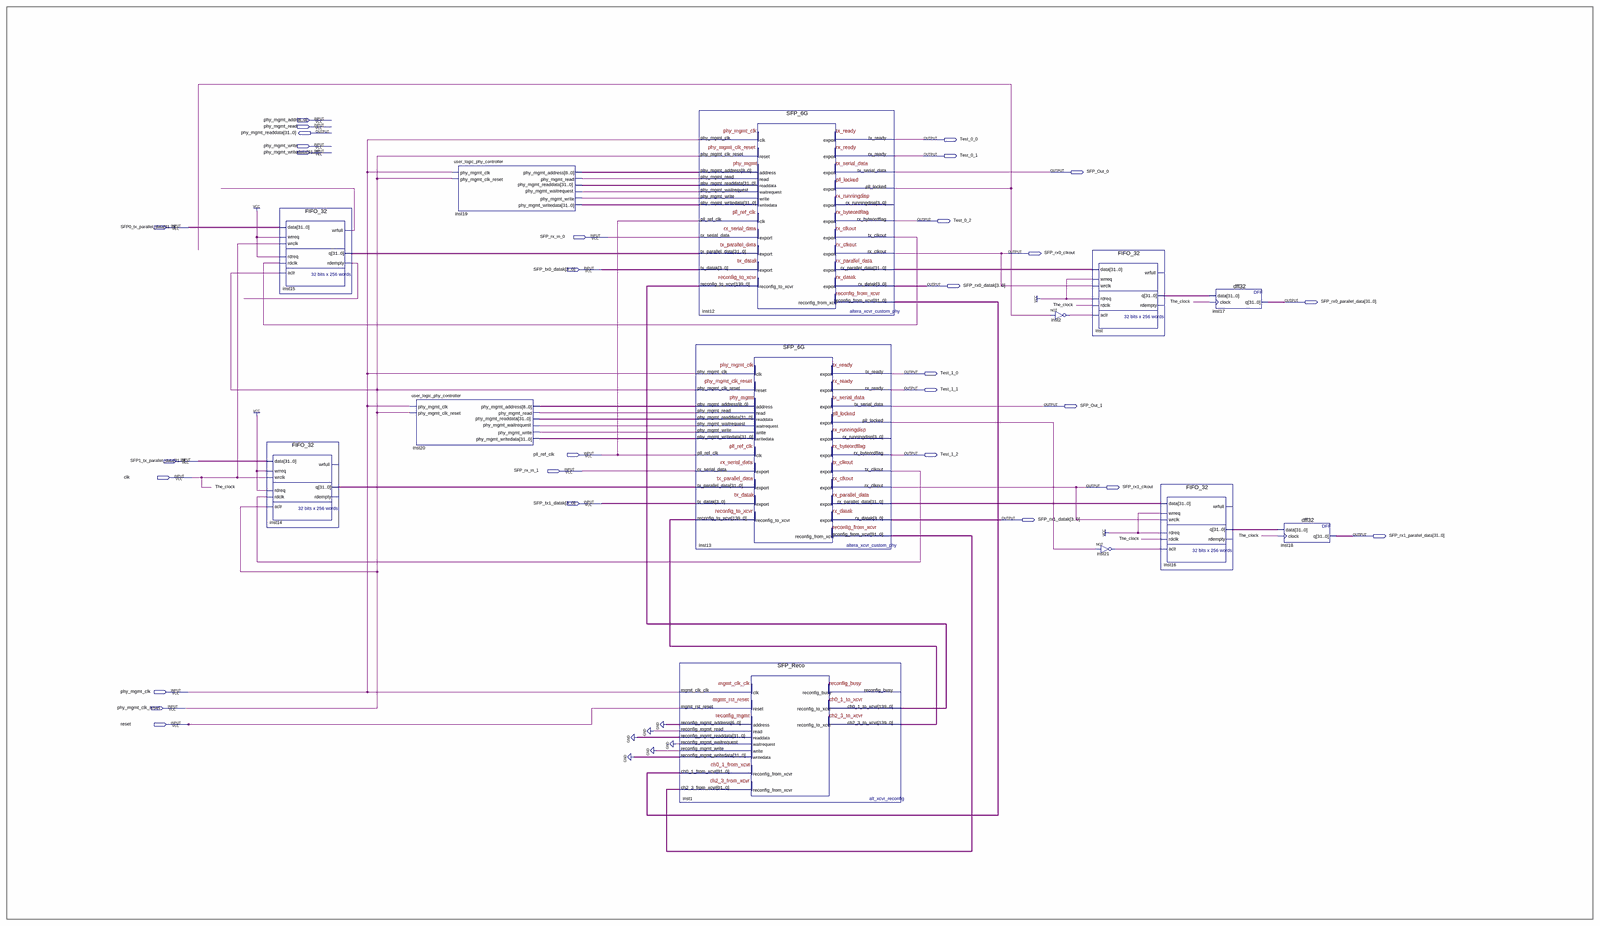
[diagram p0: schematic sheet, whole]
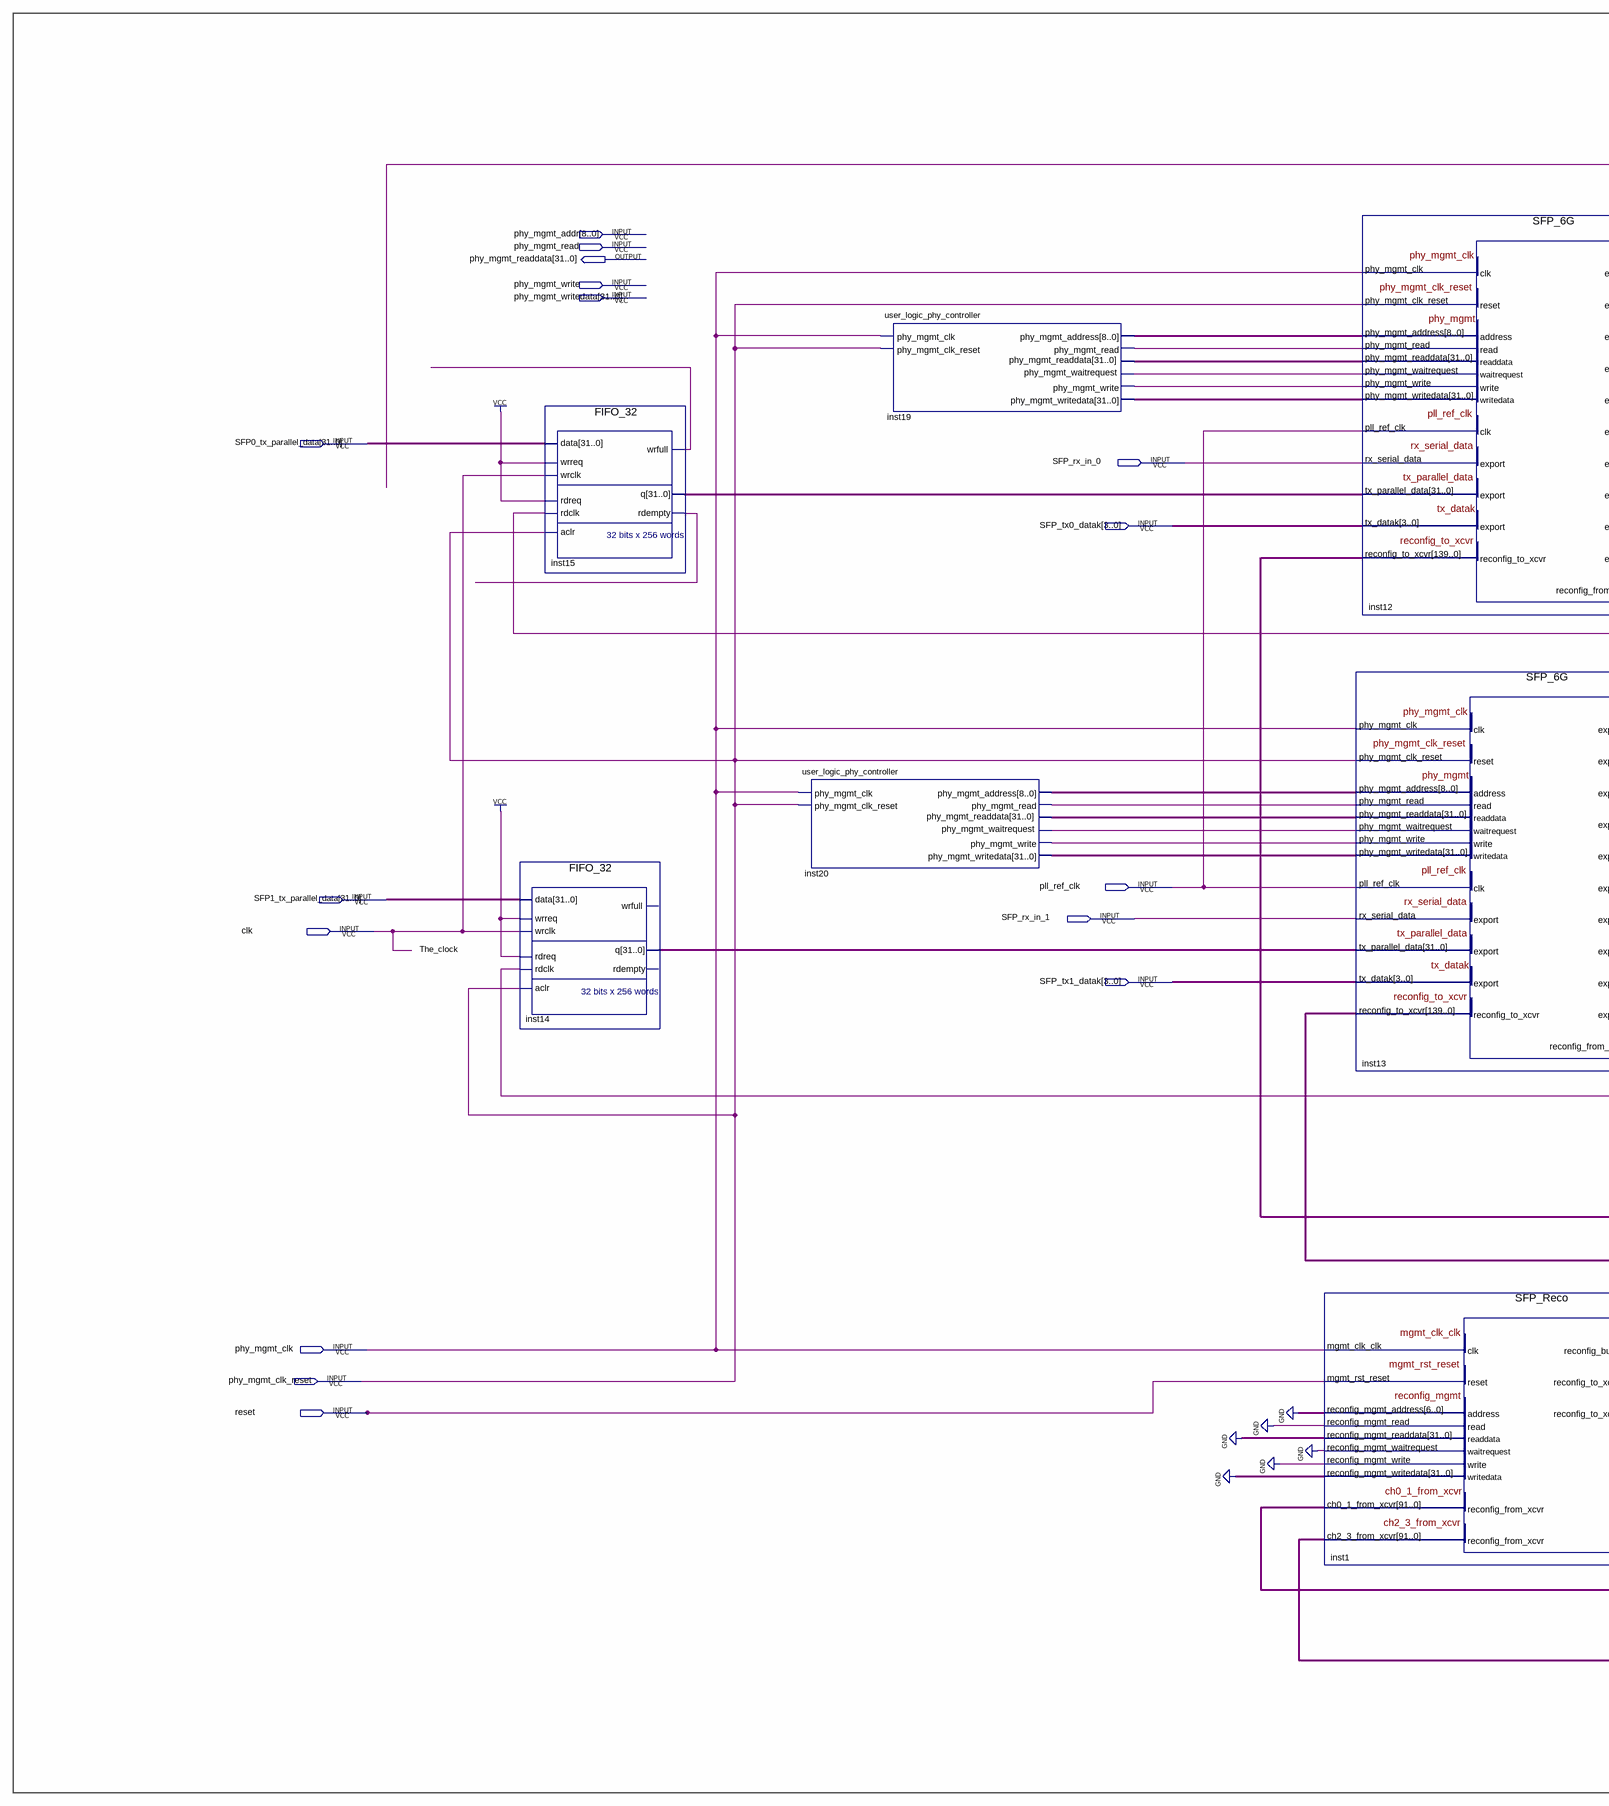
[diagram p1: schematic sheet, left part]
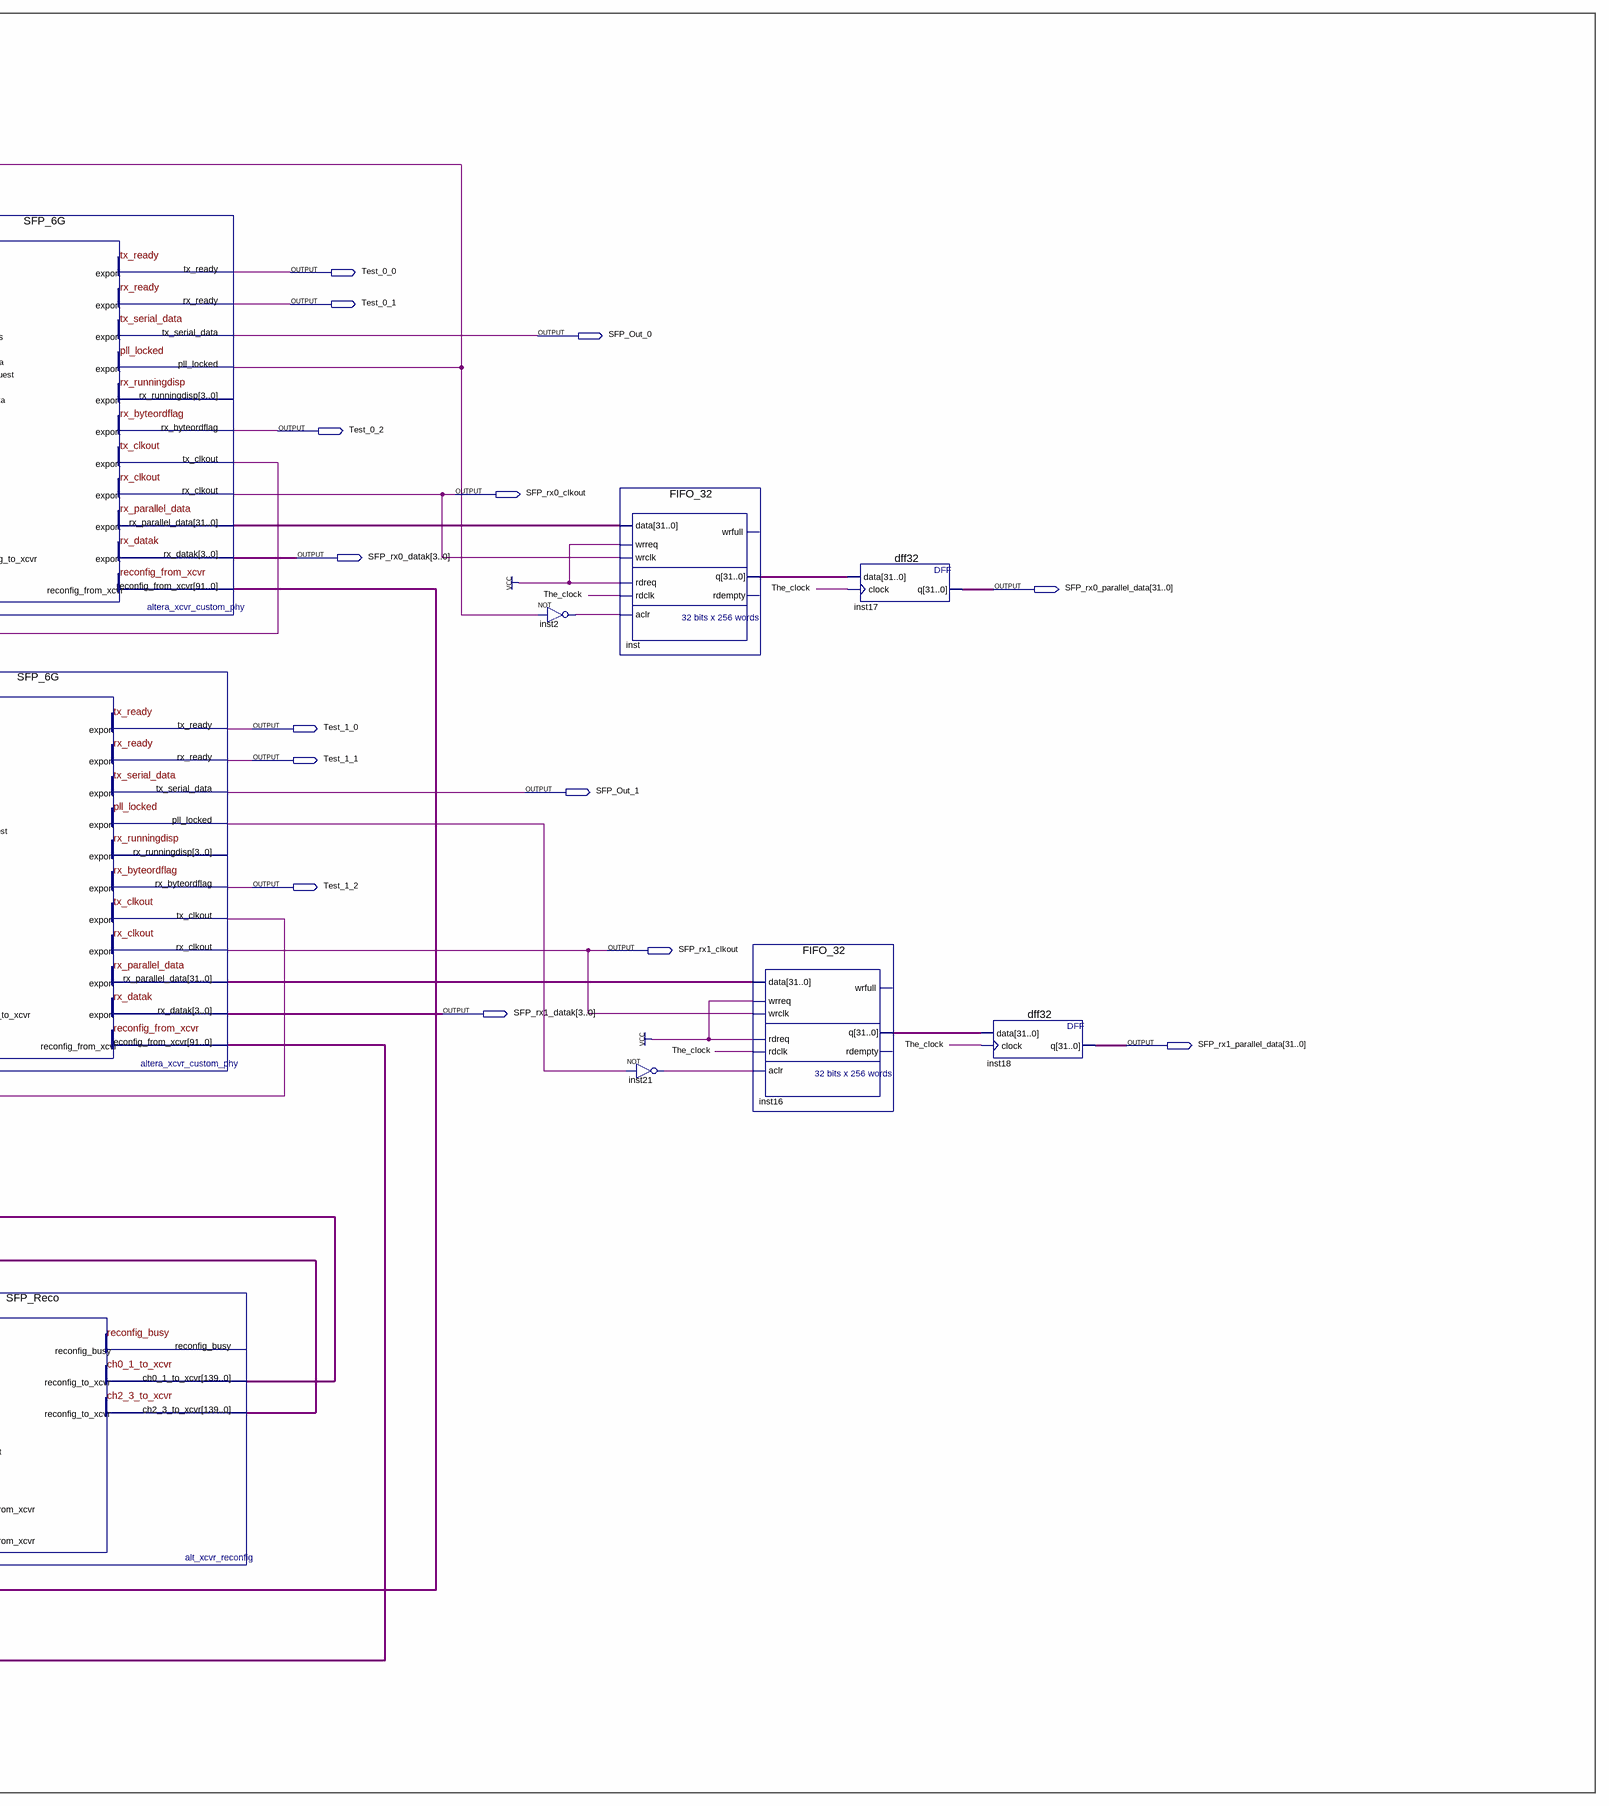
[diagram p2: schematic sheet, right part]
// Quartus schematic SFP_GxBlock_6G.bdf as structural Verilog: 13 symbols, 30 pins
module SFP_GxBlock_6G (
  input  [8:0] phy_mgmt_addr,
  input  phy_mgmt_read,
  input  phy_mgmt_write,
  input  [31:0] phy_mgmt_writedata,
  input  [31:0] SFP0_tx_parallel_data,
  input  SFP_rx_in_0,
  input  [3:0] SFP_tx0_datak,
  input  pll_ref_clk,
  input  [31:0] SFP1_tx_parallel_data,
  input  SFP_rx_in_1,
  input  clk,
  input  [3:0] SFP_tx1_datak,
  input  phy_mgmt_clk,
  input  phy_mgmt_clk_reset,
  input  reset,
  output [31:0] phy_mgmt_readdata,
  output Test_0_0,
  output Test_0_1,
  output SFP_Out_0,
  output Test_0_2,
  output SFP_rx0_clkout,
  output [3:0] SFP_rx0_datak,
  output [31:0] SFP_rx0_parallel_data,
  output Test_1_0,
  output Test_1_1,
  output SFP_Out_1,
  output Test_1_2,
  output SFP_rx1_clkout,
  output [3:0] SFP_rx1_datak,
  output [31:0] SFP_rx1_parallel_data
);

  wire inst1_reconfig_mgmt_waitrequest, inst2_out, inst12_phy_mgmt_waitrequest, inst12_pll_locked,
       inst12_tx_clkout, inst13_phy_mgmt_waitrequest, inst13_pll_locked, inst13_tx_clkout, inst15_rdempty,
       inst15_wrfull, inst19_phy_mgmt_read, inst19_phy_mgmt_write, inst20_phy_mgmt_read,
       inst20_phy_mgmt_write, inst21_out;
  wire [8:0] inst19_phy_mgmt_address, inst20_phy_mgmt_address;
  wire [31:0] inst1_reconfig_mgmt_readdata, inst12_phy_mgmt_readdata, inst12_rx_parallel_data,
       inst13_phy_mgmt_readdata, inst13_rx_parallel_data, inst14_q, inst15_q, inst16_q,
       inst19_phy_mgmt_writedata, inst20_phy_mgmt_writedata, inst_q;
  wire [91:0] inst12_reconfig_from_xcvr, inst13_reconfig_from_xcvr;
  wire [139:0] inst1_ch0_1_to_xcvr, inst1_ch2_3_to_xcvr;

  FIFO_32 inst14 (
    .data(SFP1_tx_parallel_data), .wrreq(1'b1), .wrclk(clk), .rdreq(1'b1), .rdclk(inst13_tx_clkout),
    .aclr(phy_mgmt_clk_reset), .q(inst14_q));  // open: wrfull, rdempty
  FIFO_32 inst15 (
    .data(SFP0_tx_parallel_data), .wrreq(1'b1), .wrclk(clk), .rdreq(1'b1), .rdclk(inst12_tx_clkout),
    .aclr(phy_mgmt_clk_reset), .wrfull(inst15_wrfull), .q(inst15_q), .rdempty(inst15_rdempty));
  user_logic_phy_controller inst20 (
    .phy_mgmt_clk(phy_mgmt_clk), .phy_mgmt_clk_reset(phy_mgmt_clk_reset),
    .phy_mgmt_readdata(inst13_phy_mgmt_readdata), .phy_mgmt_waitrequest(inst13_phy_mgmt_waitrequest),
    .phy_mgmt_address(inst20_phy_mgmt_address), .phy_mgmt_read(inst20_phy_mgmt_read),
    .phy_mgmt_write(inst20_phy_mgmt_write), .phy_mgmt_writedata(inst20_phy_mgmt_writedata));
  user_logic_phy_controller inst19 (
    .phy_mgmt_clk(phy_mgmt_clk), .phy_mgmt_clk_reset(phy_mgmt_clk_reset),
    .phy_mgmt_readdata(inst12_phy_mgmt_readdata), .phy_mgmt_waitrequest(inst12_phy_mgmt_waitrequest),
    .phy_mgmt_address(inst19_phy_mgmt_address), .phy_mgmt_read(inst19_phy_mgmt_read),
    .phy_mgmt_write(inst19_phy_mgmt_write), .phy_mgmt_writedata(inst19_phy_mgmt_writedata));
  SFP_Reco inst1 (
    .mgmt_clk_clk(phy_mgmt_clk), .mgmt_rst_reset(reset), .reconfig_mgmt_address({7{1'b0}}),
    .reconfig_mgmt_read(1'b0), .reconfig_mgmt_write(1'b0), .reconfig_mgmt_writedata({32{1'b0}}),
    .ch0_1_from_xcvr(inst12_reconfig_from_xcvr), .ch2_3_from_xcvr(inst13_reconfig_from_xcvr),
    .reconfig_mgmt_readdata(inst1_reconfig_mgmt_readdata),
    .reconfig_mgmt_waitrequest(inst1_reconfig_mgmt_waitrequest), .ch0_1_to_xcvr(inst1_ch0_1_to_xcvr),
    .ch2_3_to_xcvr(inst1_ch2_3_to_xcvr));  // open: reconfig_busy
  SFP_6G inst12 (
    .phy_mgmt_clk(phy_mgmt_clk), .phy_mgmt_clk_reset(phy_mgmt_clk_reset),
    .phy_mgmt_address(inst19_phy_mgmt_address), .phy_mgmt_read(inst19_phy_mgmt_read),
    .phy_mgmt_write(inst19_phy_mgmt_write), .phy_mgmt_writedata(inst19_phy_mgmt_writedata),
    .pll_ref_clk(pll_ref_clk), .rx_serial_data(SFP_rx_in_0), .tx_parallel_data(inst15_q),
    .tx_datak(SFP_tx0_datak), .reconfig_to_xcvr(inst1_ch0_1_to_xcvr),
    .phy_mgmt_readdata(inst12_phy_mgmt_readdata), .phy_mgmt_waitrequest(inst12_phy_mgmt_waitrequest),
    .tx_ready(Test_0_0), .rx_ready(Test_0_1), .tx_serial_data(SFP_Out_0), .pll_locked(inst12_pll_locked),
    .rx_byteordflag(Test_0_2), .tx_clkout(inst12_tx_clkout), .rx_clkout(SFP_rx0_clkout),
    .rx_parallel_data(inst12_rx_parallel_data), .rx_datak(SFP_rx0_datak),
    .reconfig_from_xcvr(inst12_reconfig_from_xcvr));  // open: rx_runningdisp
  SFP_6G inst13 (
    .phy_mgmt_clk(phy_mgmt_clk), .phy_mgmt_clk_reset(phy_mgmt_clk_reset),
    .phy_mgmt_address(inst20_phy_mgmt_address), .phy_mgmt_read(inst20_phy_mgmt_read),
    .phy_mgmt_write(inst20_phy_mgmt_write), .phy_mgmt_writedata(inst20_phy_mgmt_writedata),
    .pll_ref_clk(pll_ref_clk), .rx_serial_data(SFP_rx_in_1), .tx_parallel_data(inst14_q),
    .tx_datak(SFP_tx1_datak), .reconfig_to_xcvr(inst1_ch2_3_to_xcvr),
    .phy_mgmt_readdata(inst13_phy_mgmt_readdata), .phy_mgmt_waitrequest(inst13_phy_mgmt_waitrequest),
    .tx_ready(Test_1_0), .rx_ready(Test_1_1), .tx_serial_data(SFP_Out_1), .pll_locked(inst13_pll_locked),
    .rx_byteordflag(Test_1_2), .tx_clkout(inst13_tx_clkout), .rx_clkout(SFP_rx1_clkout),
    .rx_parallel_data(inst13_rx_parallel_data), .rx_datak(SFP_rx1_datak),
    .reconfig_from_xcvr(inst13_reconfig_from_xcvr));  // open: rx_runningdisp
  not inst2 (inst2_out, inst12_pll_locked);
  FIFO_32 inst (
    .data(inst12_rx_parallel_data), .wrreq(1'b1), .wrclk(SFP_rx0_clkout), .rdreq(1'b1), .rdclk(clk),
    .aclr(inst2_out), .q(inst_q));  // open: wrfull, rdempty
  not inst21 (inst21_out, inst13_pll_locked);
  FIFO_32 inst16 (
    .data(inst13_rx_parallel_data), .wrreq(1'b1), .wrclk(SFP_rx1_clkout), .rdreq(1'b1), .rdclk(clk),
    .aclr(inst21_out), .q(inst16_q));  // open: wrfull, rdempty
  dff32 inst17 (.data(inst_q), .clock(clk), .q(SFP_rx0_parallel_data));
  dff32 inst18 (.data(inst16_q), .clock(clk), .q(SFP_rx1_parallel_data));
  // also tied to GND on the sheet: {inst1_reconfig_mgmt_readdata[0], inst1_reconfig_mgmt_readdata[1], inst1_reconfig_mgmt_readdata[2], inst1_reconfig_mgmt_readdata[3], inst1_reconfig_mgmt_readdata[4], inst1_reconfig_mgmt_readdata[5], inst1_reconfig_mgmt_readdata[6], inst1_reconfig_mgmt_readdata[7], inst1_reconfig_mgmt_readdata[8], inst1_reconfig_mgmt_readdata[9], inst1_reconfig_mgmt_readdata[10], inst1_reconfig_mgmt_readdata[11], inst1_reconfig_mgmt_readdata[12], inst1_reconfig_mgmt_readdata[13], inst1_reconfig_mgmt_readdata[14], inst1_reconfig_mgmt_readdata[15], inst1_reconfig_mgmt_readdata[16], inst1_reconfig_mgmt_readdata[17], inst1_reconfig_mgmt_readdata[18], inst1_reconfig_mgmt_readdata[19], inst1_reconfig_mgmt_readdata[20], inst1_reconfig_mgmt_readdata[21], inst1_reconfig_mgmt_readdata[22], inst1_reconfig_mgmt_readdata[23], inst1_reconfig_mgmt_readdata[24], inst1_reconfig_mgmt_readdata[25], inst1_reconfig_mgmt_readdata[26], inst1_reconfig_mgmt_readdata[27], inst1_reconfig_mgmt_readdata[28], inst1_reconfig_mgmt_readdata[29], inst1_reconfig_mgmt_readdata[30], inst1_reconfig_mgmt_readdata[31], inst1_reconfig_mgmt_waitrequest}

  // Other names for the same wires on the sheet: The_clock = clk
endmodule
